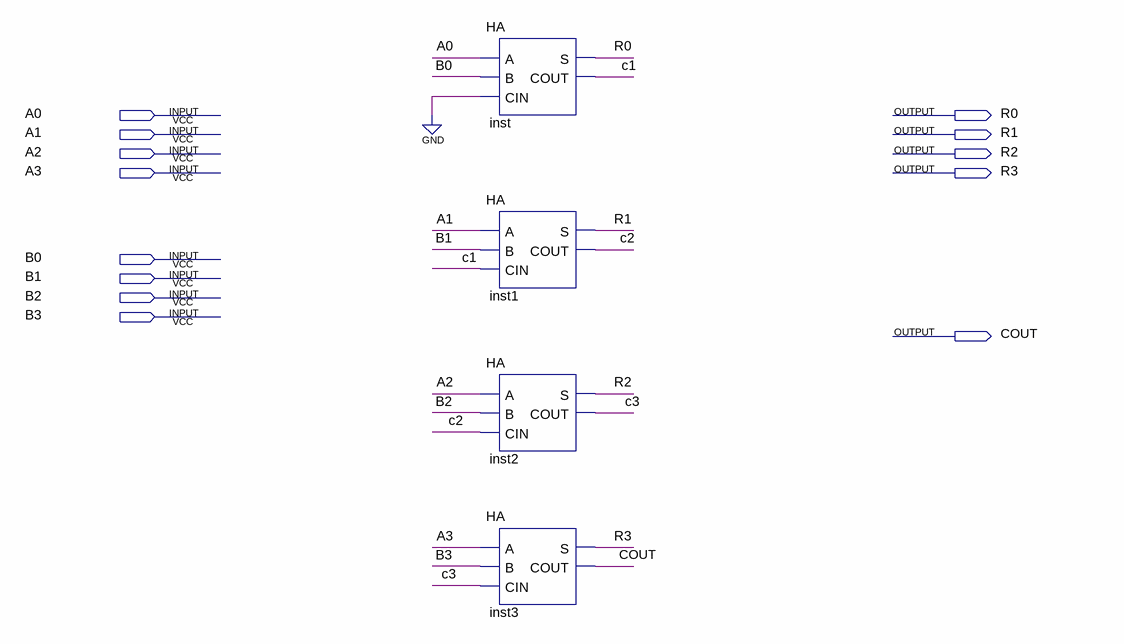
[diagram p0: schematic sheet]
// Quartus schematic FA.bdf as structural Verilog: 4 symbols, 13 pins
module FA (
  input  A0,
  input  A1,
  input  A2,
  input  A3,
  input  B0,
  input  B1,
  input  B2,
  input  B3,
  output R0,
  output R1,
  output R2,
  output R3,
  output COUT
);

  wire c1, c2, c3;

  HA inst (.A(A0), .B(B0), .CIN(1'b0), .S(R0), .COUT(c1));
  HA inst1 (.A(A1), .B(B1), .CIN(c1), .S(R1), .COUT(c2));
  HA inst2 (.A(A2), .B(B2), .CIN(c2), .S(R2), .COUT(c3));
  HA inst3 (.A(A3), .B(B3), .CIN(c3), .S(R3), .COUT(COUT));
endmodule
